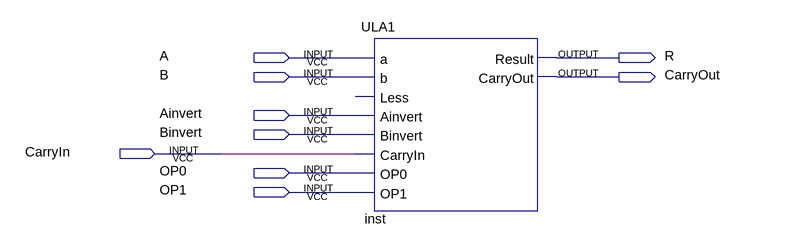
[diagram p0: schematic sheet]
// Quartus schematic teste_ula_1bit.bdf as structural Verilog: 1 symbols, 9 pins
module teste_ula_1bit (
  input  A,
  input  B,
  input  Ainvert,
  input  Binvert,
  input  CarryIn,
  input  OP0,
  input  OP1,
  output R,
  output CarryOut
);

  ULA1 inst (
    .a(A), .b(B), .Ainvert(Ainvert), .Binvert(Binvert), .CarryIn(CarryIn), .OP0(OP0), .OP1(OP1), .Result(R),
    .CarryOut(CarryOut));  // open: Less
endmodule
